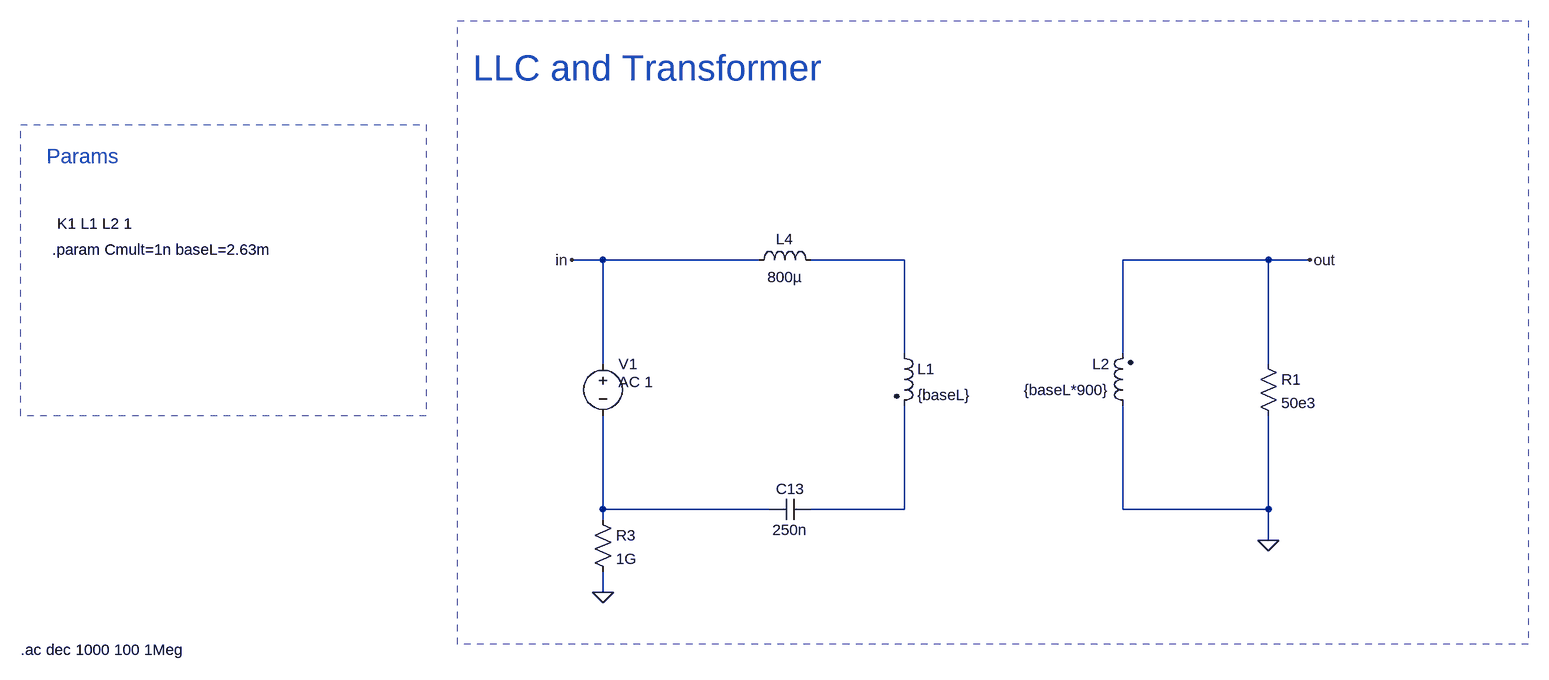
[diagram p0: schematic LLC.asc]
LLC.asc, the LTspice schematic file:
Version 4.1
SHEET 1 1636 1108
WIRE -1248 64 -1296 64
WIRE -1008 64 -1248 64
WIRE -784 64 -928 64
WIRE -224 64 -448 64
WIRE -160 64 -224 64
WIRE -784 208 -784 64
WIRE -448 208 -448 64
WIRE -1248 224 -1248 64
WIRE -224 224 -224 64
WIRE -1248 448 -1248 304
WIRE -992 448 -1248 448
WIRE -784 448 -784 288
WIRE -784 448 -928 448
WIRE -448 448 -448 288
WIRE -224 448 -224 304
WIRE -224 448 -448 448
WIRE -1248 464 -1248 448
WIRE -224 496 -224 448
WIRE -1248 576 -1248 544
FLAG -1296 64 in
FLAG -1248 576 0
FLAG -224 496 0
FLAG -160 64 out
SYMBOL ind2 -432 304 R180
WINDOW 0 36 80 Left 2
WINDOW 3 36 40 Left 2
SYMATTR InstName L2
SYMATTR Value {baseL*900}
SYMATTR Type ind
SYMBOL ind2 -800 192 R0
SYMATTR InstName L1
SYMATTR Value {baseL}
SYMATTR Type ind
SYMATTR SpiceLine Rser=0
SYMBOL ind -1024 80 R270
WINDOW 0 32 56 VTop 2
WINDOW 3 5 56 VBottom 2
SYMATTR InstName L4
SYMATTR Value 800µ
SYMATTR SpiceLine Rser=1m
SYMBOL cap -928 432 R90
WINDOW 0 0 32 VBottom 2
WINDOW 3 32 32 VTop 2
SYMATTR InstName C13
SYMATTR Value 250n
SYMBOL voltage -1248 208 R0
WINDOW 3 24 152 Left 2
WINDOW 123 24 44 Left 2
WINDOW 39 0 0 Left 0
SYMATTR Value ""
SYMATTR Value2 AC 1
SYMATTR InstName V1
SYMBOL res -1264 448 R0
SYMATTR InstName R3
SYMATTR Value 1G
SYMBOL res -240 208 R0
SYMATTR InstName R1
SYMATTR Value 50e3
TEXT -1448 -232 Left 5 ;LLC and Transformer
TEXT -2088 8 Left 2 !K1 L1 L2 1
TEXT -2096 48 Left 2 !.param Cmult=1n baseL=2.63m
TEXT -2104 -96 Left 3 ;Params
TEXT -2144 664 Left 2 !.ac dec 1000 100 1Meg
RECTANGLE Normal -1520 304 -2144 -144 1
RECTANGLE Normal 176 656 -1472 -304 1

The netlist it stands for:
* LLC.asc
L2 0 out {baseL*900}
L1 N001 N003 {baseL} Rser=0
L4 in N001 800µ Rser=1m
C13 N003 N002 250n
V1 in N002 AC 1
R3 N002 0 1G
R1 out 0 50e3
* LLC and Transformer
K1 L1 L2 1
.param Cmult=1n baseL=2.63m
* Params
.ac dec 1000 100 1Meg
.backanno
.end